# EAGLE schematic Data Acquisition (EAGLE 8.6.3)
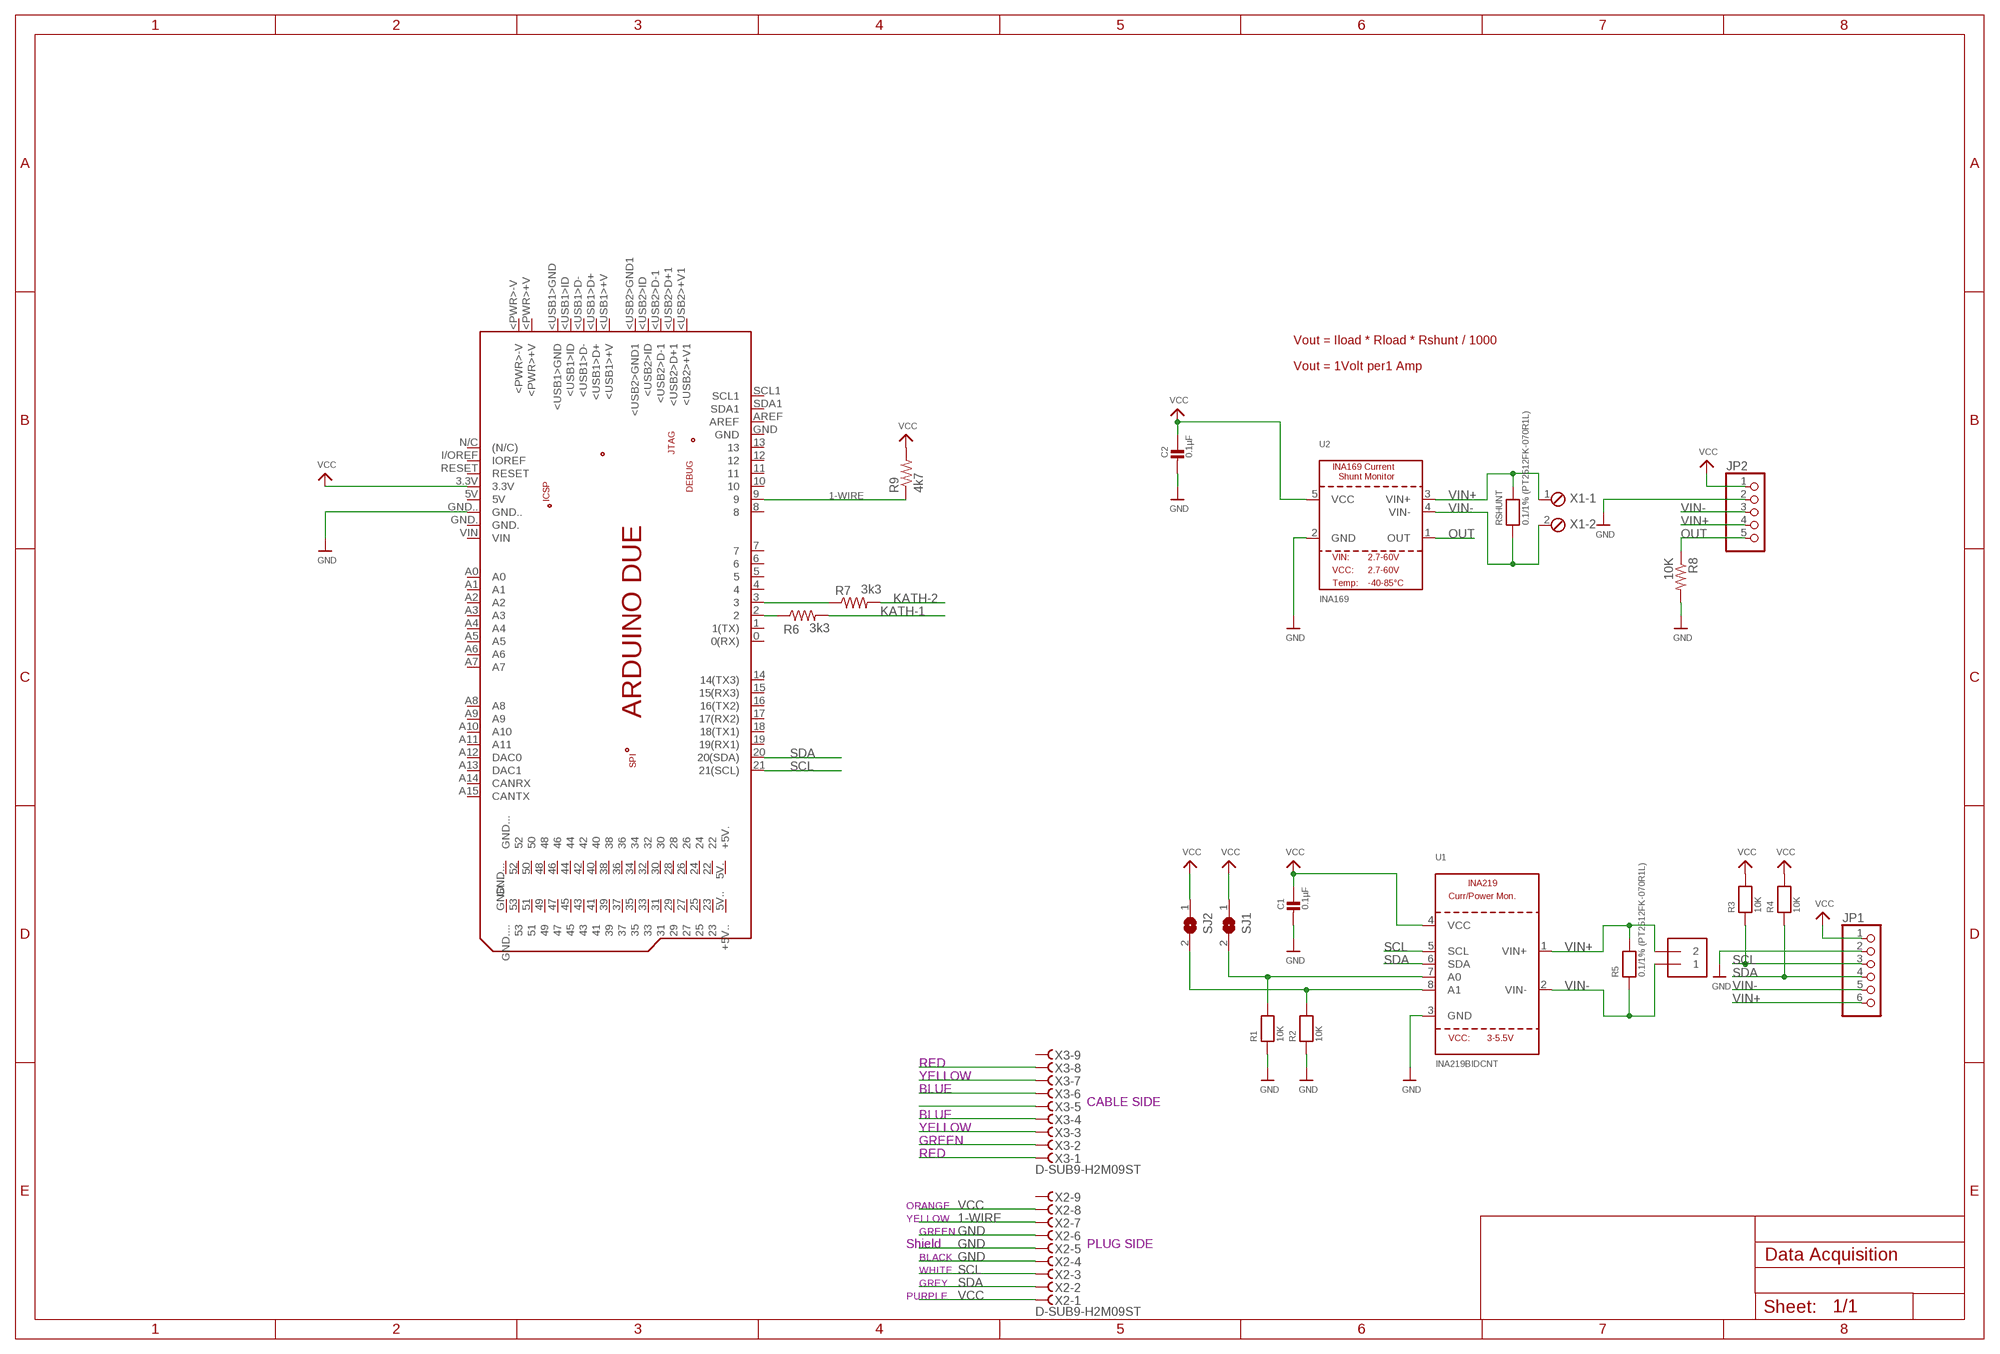
[diagram p0: schematic, sheet 1]

## Parts
C1  0.1µF  CAP_CERAMIC0805  [0805]
C2  0.1µF  CAP_CERAMIC0805  [0805]
J1  TERMBLOCK_1X2-3.5MM  [1X2-3.5MM]
JP1  HEADER-1X670MIL  [1X06_ROUND_70]
JP2  HEADER-1X570MIL  [1X05_ROUND_70]
PCB1  ARDUINO_DUE  [ARDUINO_DUE]
R1  10K  RESISTOR0805  [0805]
R2  10K  RESISTOR0805  [0805]
R3  10K  RESISTOR0805  [0805]
R4  10K  RESISTOR0805  [0805]
R5  0.1/1% (PT2512FK-070R1L)  RESISTOR2512  [2512]
R6  3k3  R-US_0204/7  [0204/7]
R7  3k3  R-US_0204/7  [0204/7]
R8  10K  RESISTOR_DUAL  [0805-THM]
R9  4k7  R-US_0207/10  [0207/10]
RSHUNT  0.1/1% (PT2512FK-070R1L)  RESISTOR2512  [2512]
SJ1  SOLDERJUMPERREFLOW_NOPASTE  [SOLDERJUMPER_REFLOW_NOPASTE]
SJ2  SOLDERJUMPERREFLOW_NOPASTE  [SOLDERJUMPER_REFLOW_NOPASTE]
U1  INA219BIDCNT  INA219  [SOT23-8]
U2  INA169  [SOT23-5]
X1  MPT2  [2POL254]
X2  D-SUB9-H2M09ST  [H2M09ST]
X3  D-SUB9-H2M09ST  [H2M09ST]

## Nets
1-WIRE: PCB1.9 R9.1 X2.7
GND: C1.2 C2.2 JP1.2 JP2.2 PCB1.GND.. R1.1 R2.1 R8.2 U1.3(GND) U2.2(GND) X2.4 X2.5 X2.6
K1: PCB1.2 R6.1
K2: PCB1.3 R7.1
KATH-1: R6.2
KATH-2: R7.2
N$1: R2.2 SJ2.2 U1.8(A1)
N$2: R1.2 SJ1.2 U1.7(A0)
N$3: X3.1
N$4: X3.2
N$5: X3.3
N$6: X3.4
N$7: X3.5
N$8: X3.6
N$9: X3.7
N$10: X3.8
OUT: JP2.5 R8.1 U2.1(OUT)
SCL: JP1.3 PCB1.21(21(SCL)) R3.1 U1.5(SCL) X2.3
SDA: JP1.4 PCB1.20(20(SDA)) R4.1 U1.6(SDA) X2.2
VCC: C1.1 C2.1 JP1.1 JP2.1 PCB1.3.3V R3.2 R4.2 R9.2 SJ1.1 SJ2.1 U1.4(VCC) U2.5(VCC) X2.1 X2.8
VIN+: J1.2 JP1.6 JP2.4 R5.2 RSHUNT.2 U1.1(VIN+) U2.3(VIN+) X1.1
VIN-: J1.1 JP1.5 JP2.3 R5.1 RSHUNT.1 U1.2(VIN-) U2.4(VIN-) X1.2
Unconnected: PCB1.0(0(RX)) PCB1.1(1(TX)) PCB1.4 PCB1.5 PCB1.5V PCB1.5V.(+5V.) PCB1.5V..(+5V..) PCB1.6 PCB1.7 PCB1.8 PCB1.10 PCB1.11 PCB1.12 PCB1.13 PCB1.14(14(TX3)) PCB1.15(15(RX3)) PCB1.16(16(TX2)) PCB1.17(17(RX2)) PCB1.18(18(TX1)) PCB1.19(19(RX1)) PCB1.22 PCB1.23 PCB1.24 PCB1.25 PCB1.26 PCB1.27 PCB1.28 PCB1.29 PCB1.30 PCB1.31 PCB1.32 PCB1.33 PCB1.34 PCB1.35 PCB1.36 PCB1.37 PCB1.38 PCB1.39 PCB1.40 PCB1.41 PCB1.42 PCB1.43 PCB1.44 PCB1.45 PCB1.46 PCB1.47 PCB1.48 PCB1.49 PCB1.50 PCB1.51 PCB1.52 PCB1.53 PCB1.+3.3V PCB1.+5V PCB1.+5V_ PCB1.<PWR>+V PCB1.<PWR>-V PCB1.<USB1>+V PCB1.<USB1>D+ PCB1.<USB1>D- PCB1.<USB1>GND PCB1.<USB1>ID PCB1.<USB2>+V1 PCB1.<USB2>D+1 PCB1.<USB2>D-1 PCB1.<USB2>GND1 PCB1.<USB2>ID PCB1.A0 PCB1.A1 PCB1.A2 PCB1.A3 PCB1.A4 PCB1.A5 PCB1.A6 PCB1.A7 PCB1.A8 PCB1.A9 PCB1.A10 PCB1.A11 PCB1.A12(DAC0) PCB1.A13(DAC1) PCB1.A14(CANRX) PCB1.A15(CANTX) PCB1.AREF PCB1.GND PCB1.GND1 PCB1.GND1. PCB1.GND1.. PCB1.GND1... PCB1.GND. PCB1.GND... PCB1.GND.... PCB1.GND_ PCB1.GND__ PCB1.I/OREF(IOREF) PCB1.MISO PCB1.MISO2 PCB1.MOSI PCB1.MOSI2 PCB1.N/C((N/C)) PCB1.N/C. PCB1.RESET PCB1.RESET2 PCB1.RESET. PCB1.RESET.. PCB1.RESET_ PCB1.SCK PCB1.SCK2 PCB1.SCL1 PCB1.SDA1 PCB1.SWCLK PCB1.SWDIO PCB1.TCK PCB1.TDI PCB1.TDO PCB1.TMS PCB1.VIN X2.9 X3.9

## Notes on the sheet
- Vout = Iload * Rload * Rshunt / 1000
- Vout = 1Volt per1 Amp
- RED
- YELLOW
- BLUE
- CABLE SIDE
- BLUE
- YELLOW
- GREEN
- RED
- ORANGE
- YELLOW
- GREEN
- Shield | PLUG SIDE
- BLACK
- WHITE
- GREY
- PURPLE

## Library data of the parts
C1 C2 = microbuilder:CAP_CERAMIC: Ceramic Capacitors For new designs, use the packages preceded by an '_' character since they are more reliable: The following footprints should be used on most boards: _0402 - Standard footprint for regular board layouts _0603 - Standard footprint for regular board layouts _0805 - Standard footprint for regular board layouts For extremely tight-pitch boards where space is at a premium, the following 'micro-pitch' footprints can be used (smaller pads, no silkscreen outline, etc.): _0402MP - Micro-pitch footprint for very dense/compact boards _0603MP - Micro-pitch footprint for very dense/compact boards _0805MP - Micro-pitch footprint for very dense/compact boards Commonly Stocked Parts 0402 - 0402 Surface Mount Capacitors 16pF 50V 5% [Digikey: 445-4899-2-ND] 18pF 50V 5% [Digikey: 490-1281-2-ND] 22pF 50V 5% [Digikey: 490-1283-2-ND] 68pF 50V 5% [Digikey: 490-1289-2-ND] 0.1uF 10V 10% [Digikey: 490-1318-2-ND] 1.0uF 6.3V 10% [Digikey: 490-1320-2-ND] 0603 - 0603 Surface Mount Capacitors 16 pF 50V 5% [Digikey: 445-5051-2-ND] 22 pF 50V [Digikey: PCC220ACVTR-ND] 33 pF 50V 5% [Digikey: 490-1415-1-ND] 56pF 50V 5% [Digikey: 490-1421-1-ND] 220pF 50V 5% [Digikey: 445-1285-1-ND] 680 pF 50V 2200 pF 50V 5% C0G [Digikey: 445-1297-1-ND] 5600 pF 100V 5% X7R [Digikey: 478-3711-1-ND] 0.1 µF 25V 10% [Digikey: PCC2277TR-ND] 0.22 µF 16V 10% X7R [Digikey: 445-1318-1-ND] 1.0 µF 25V 10% [Digikey: 445-5146-2-ND] 0603 - RF Specific 3pF 250V +/-0.1pF RF [Digikey: 712-1347-1-ND] 18 pF 250V 5% [Digikey: 478-3505-1-ND or 712-1322-1-ND] 56 pF 250V 5% C0G RF [Digikey: 490-4867-1-ND] 68 pF 250V RF [Digikey: 490-4868-1-ND] 0805 - 0805 Surface Mount Capacitors 220 pF 250V 2% RF Ceramic Capacitor [Digikey: 712-1398-1-ND] 1000 pF 50V 2% NP0 Ceramic Capacitor [Digikey: 478-3760-1-ND] 0.1 µF 25V 10% Ceramic Capacitor [Digikey: PCC1828TR-ND] 1.0 µF 16V 10% Ceramic Capacitor[Digikey: 490-1691-2-ND] 10.0 µF 10V 10% Ceramic Capacitor[Digikey: 709-1228-1-ND] 10.0 uF 16V 10% Ceramic Capacitor [Digikey: 478-5165-2-ND] 47 uF 6.3V 20% Ceramic Capacitor [Digikey: 587-1779-1-ND or 399-5506-1-ND] 1206 - 1206 Surface Mount Capacitors 47uF 10V 20% Ceramic Capacitor [Digikey: 490-5528-1-ND or 399-5508-1-ND or 445-6010-1-ND] 100uF 6.3V -20%, +80% Y5V Ceramic Capacitor (Digikey: 490-4512-1-ND, Mouser: 81-GRM31CF50J107ZE1L)
J1 = microbuilder:TERMBLOCK_1X2: 3.5mm Terminal block http://www.ladyada.net/library/pcb/eaglelibrary.html
JP1 = microbuilder:HEADER-1X6: PIN HEADER
JP2 = microbuilder:HEADER-1X5: PIN HEADER
PCB1 = E14_Arduino_revC:ARDUINO_DUE: Device for representing an Arduino Due board with a footprint in an EAGLE design. Created by Dave Young for Element14. More EAGLE documentation at: http://www.element14.com/community/community/knode/cadsoft_eagle
R1-R5 RSHUNT = microbuilder:RESISTOR: Resistors For new designs, use the packages preceded by an '_' character since they are more reliable: The following footprints should be used on most boards: _0402 - Standard footprint for regular board layouts _0603 - Standard footprint for regular board layouts _0805 - Standard footprint for regular board layouts For extremely tight-pitch boards where space is at a premium, the following 'micro-pitch' footprints can be used (smaller pads, no silkscreen outline, etc.): _0402MP - Micro-pitch footprint for very dense/compact boards _0603MP - Micro-pitch footprint for very dense/compact boards _0805MP - Micro-pitch footprint for very dense/compact boards
R6 R7 = adafruit:R-US_: RESISTOR, American symbol
R8 = microbuilder:RESISTOR_DUAL: Flip Flop resistor An 0805 resistor inside a standard 1/4W 5% resistor. Makes for easy mods Footprint taken from the Adafruit Industries Eagle Library.
R9 = rcl:R-US_: RESISTOR, American symbol; SPICEPREFIX: R
SJ1 SJ2 = microbuilder:SOLDERJUMPER: SMD Solder JUMPER Solder the two pads together to create a connection, or remove the solder to break it. REFLOW - Use this footprint for solder paste and reflow ovens. WAVE - Use this footprint for hand-soldering (larger pads). CLOSED - Has a trace between the two pads to ensure it is closed by default. The trace needs to be cut to disable the jumper, and can be closed again by creating a solder bridge between the two pads.
U1 = microbuilder:INA219: INA219 - I2C Current/Power Monitor Voltage Range: 0-26V Accuracy: 0.5% Temperature: -40°C - 125°C
U2 = microbuilder:INA169: INA169 - High-Side Measurement Current Shunt Monitor The device converts a differential input voltage to a current output. This current is converted back to a voltage with an external load resistor that sets any gain from 1 to over 100.
X1 = con-phoenix-254:MPT2: PHOENIX CONNECTOR; OC_FARNELL: unknown; OC_NEWARK: unknown
X2 X3 = con-thomas-betts:D-SUB9-: D-Subminiatur Connector Source: Electronioc Interconnects European Edition 1998; OC_FARNELL: unknown; OC_NEWARK: unknown